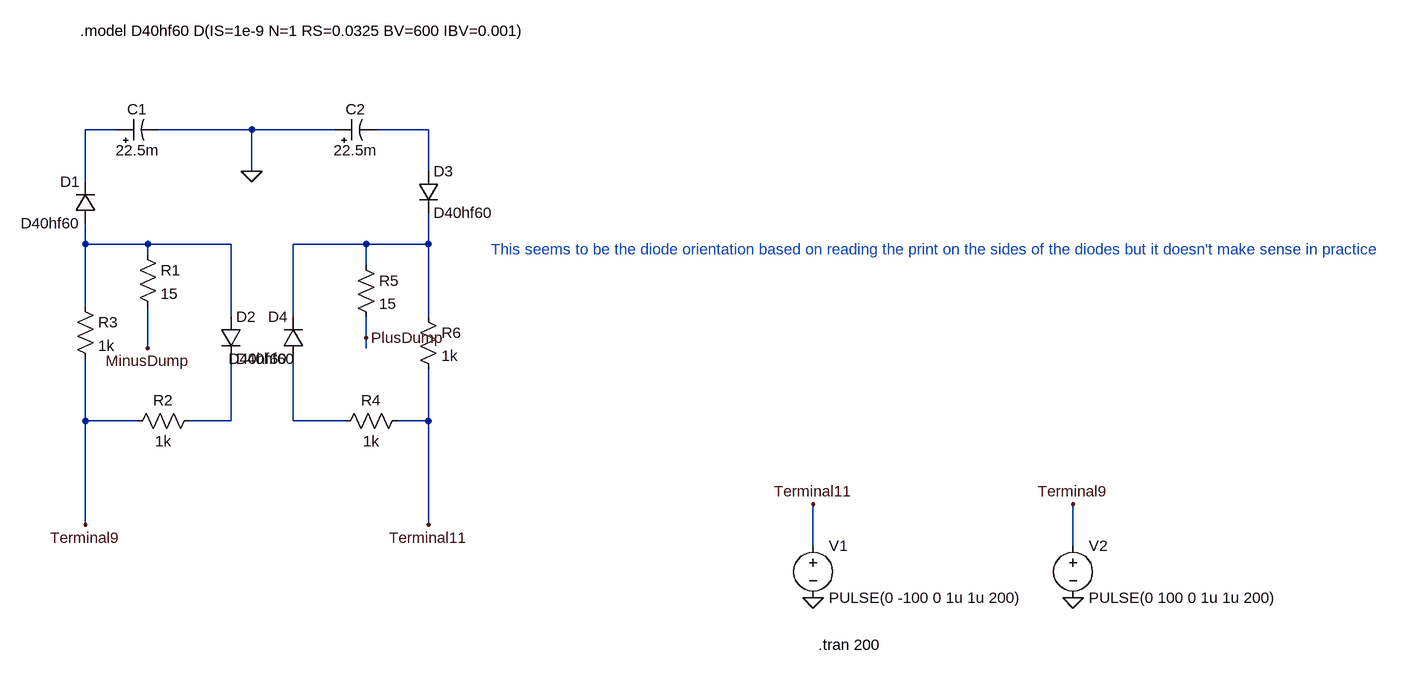
[diagram p0: schematic CapBank1_15CapSide_Simplified_OneColumn_HypothesizedDiodeConfig.asc]
CapBank1_15CapSide_Simplified_OneColumn_HypothesizedDiodeConfig.asc, the LTspice schematic file:
Version 4
SHEET 1 1952 888
WIRE -16 80 -64 80
WIRE 192 80 48 80
WIRE 320 80 192 80
WIRE 464 80 384 80
WIRE 192 144 192 80
WIRE 464 144 464 80
WIRE -64 160 -64 80
WIRE -64 256 -64 224
WIRE 32 256 -64 256
WIRE 160 256 32 256
WIRE 368 256 256 256
WIRE 464 256 464 208
WIRE 464 256 368 256
WIRE 32 272 32 256
WIRE 368 288 368 256
WIRE -64 352 -64 256
WIRE 160 368 160 256
WIRE 256 368 256 256
WIRE 464 368 464 256
WIRE 368 400 368 368
WIRE 32 416 32 352
WIRE 368 416 368 400
WIRE -64 528 -64 432
WIRE 16 528 -64 528
WIRE 160 528 160 432
WIRE 160 528 96 528
WIRE 256 528 256 432
WIRE 336 528 256 528
WIRE 464 528 464 448
WIRE 464 528 416 528
WIRE -64 688 -64 528
WIRE 464 688 464 528
WIRE 1056 720 1056 656
WIRE 1456 720 1456 656
FLAG -64 688 Terminal9
FLAG 464 688 Terminal11
FLAG 192 144 0
FLAG 1056 800 0
FLAG 1056 656 Terminal11
FLAG 1456 800 0
FLAG 1456 656 Terminal9
FLAG 32 416 MinusDump
FLAG 368 400 PlusDump
SYMBOL polcap -16 96 R270
WINDOW 0 32 32 VTop 2
WINDOW 3 0 32 VBottom 2
SYMATTR InstName C1
SYMATTR Value 22.5m
SYMBOL Diode -48 224 R180
WINDOW 0 24 64 Left 2
WINDOW 3 24 0 Left 2
SYMATTR InstName D1
SYMATTR Value D40hf60
SYMBOL Diode 144 368 R0
SYMATTR InstName D2
SYMATTR Value D40hf60
SYMBOL Res 16 256 R0
SYMATTR InstName R1
SYMATTR Value 15
SYMBOL Res 0 544 R270
WINDOW 0 32 56 VTop 2
WINDOW 3 0 56 VBottom 2
SYMATTR InstName R2
SYMATTR Value 1k
SYMBOL Res -80 336 R0
SYMATTR InstName R3
SYMATTR Value 1k
SYMBOL polcap 320 96 R270
WINDOW 0 32 32 VTop 2
WINDOW 3 0 32 VBottom 2
SYMATTR InstName C2
SYMATTR Value 22.5m
SYMBOL Diode 448 144 R0
SYMATTR InstName D3
SYMATTR Value D40hf60
SYMBOL Diode 272 432 R180
WINDOW 0 24 64 Left 2
WINDOW 3 24 0 Left 2
SYMATTR InstName D4
SYMATTR Value D40hf60
SYMBOL Res 432 512 R90
WINDOW 0 0 56 VBottom 2
WINDOW 3 32 56 VTop 2
SYMATTR InstName R4
SYMATTR Value 1k
SYMBOL Res 352 272 R0
SYMATTR InstName R5
SYMATTR Value 15
SYMBOL Res 448 352 R0
SYMATTR InstName R6
SYMATTR Value 1k
SYMBOL Voltage 1056 704 R0
SYMATTR InstName V1
SYMATTR Value PULSE(0 -100 0 1u 1u 200)
SYMBOL Voltage 1456 704 R0
SYMATTR InstName V2
SYMATTR Value PULSE(0 100 0 1u 1u 200)
TEXT -72 -72 Left 2 !.model D40hf60 D(IS=1e-9 N=1 RS=0.0325 BV=600 IBV=0.001)
TEXT 1064 872 Left 2 !.tran 200
TEXT 560 264 Left 2 ;This seems to be the diode orientation based on reading the print on the sides of the diodes but it doesn't make sense in practice

The netlist it stands for:
* CapBank1_15CapSide_Simplified_OneColumn_HypothesizedDiodeConfig.asc
C1 N001 0 22.5m
D1 N003 N001 D40hf60
D2 N003 N005 D40hf60
R1 N003 MinusDump 15
R2 Terminal9 N005 1k
R3 N003 Terminal9 1k
C2 0 N002 22.5m
D3 N002 N004 D40hf60
D4 N006 N004 D40hf60
R4 Terminal11 N006 1k
R5 N004 PlusDump 15
R6 N004 Terminal11 1k
V1 Terminal11 0 PULSE(0 -100 0 1u 1u 200)
V2 Terminal9 0 PULSE(0 100 0 1u 1u 200)
.model D D
.lib standard.dio
.model D40hf60 D(IS=1e-9 N=1 RS=0.0325 BV=600 IBV=0.001)
.tran 200
* This seems to be the diode orientation based on reading the print on the sides of the diodes but it doesn't make sense in practice
.backanno
.end